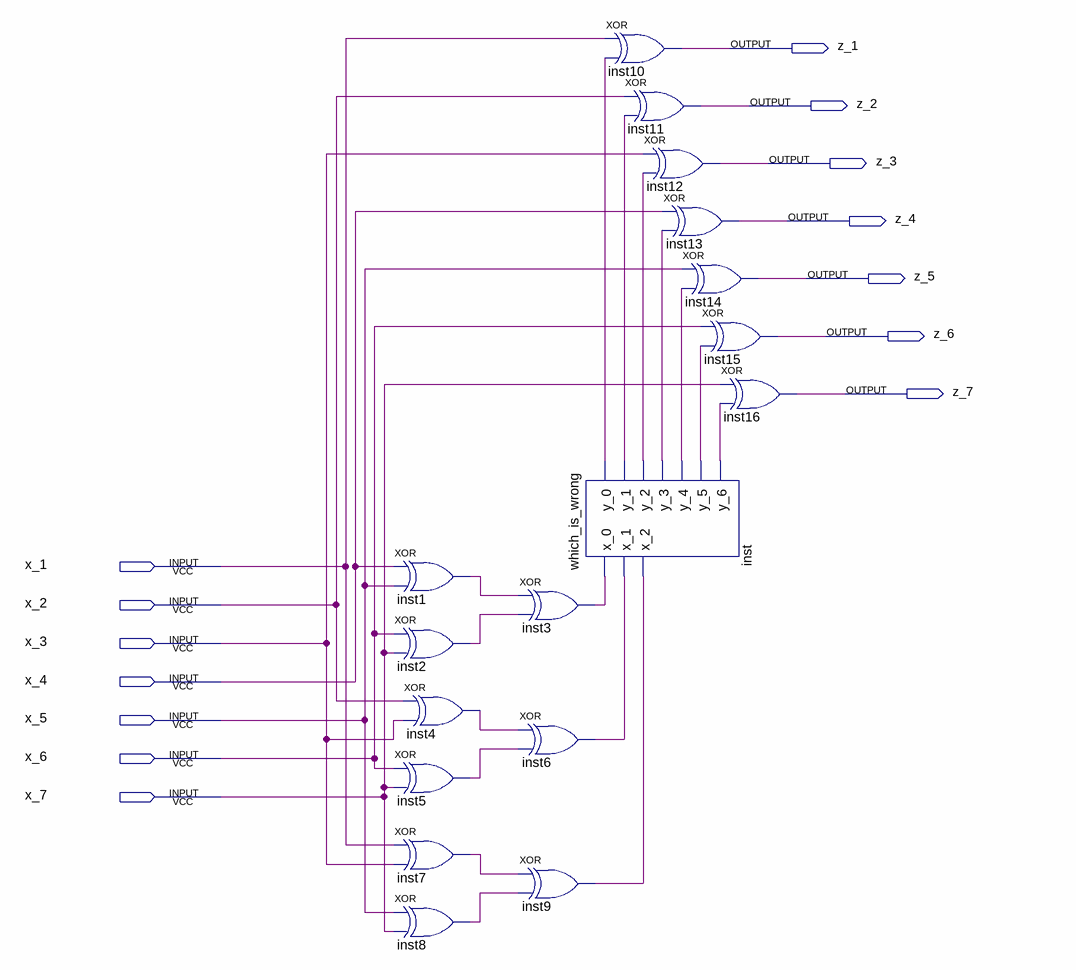
[diagram p0: schematic sheet]
// Quartus schematic decoding_H.bdf as structural Verilog: 17 symbols, 14 pins
module decoding_H (
  input  x_1,
  input  x_2,
  input  x_3,
  input  x_4,
  input  x_5,
  input  x_6,
  input  x_7,
  output z_1,
  output z_2,
  output z_3,
  output z_4,
  output z_5,
  output z_6,
  output z_7
);

  wire inst1_out, inst2_out, inst3_out, inst4_out, inst5_out, inst6_out, inst7_out, inst8_out, inst9_out,
       inst_y_0, inst_y_1, inst_y_2, inst_y_3, inst_y_4, inst_y_5, inst_y_6;

  xor inst1 (inst1_out, x_4, x_5);
  xor inst2 (inst2_out, x_6, x_7);
  xor inst4 (inst4_out, x_2, x_3);
  xor inst5 (inst5_out, x_6, x_7);
  xor inst7 (inst7_out, x_1, x_3);
  xor inst8 (inst8_out, x_5, x_7);
  xor inst3 (inst3_out, inst1_out, inst2_out);
  xor inst6 (inst6_out, inst4_out, inst5_out);
  xor inst9 (inst9_out, inst7_out, inst8_out);
  xor inst10 (z_1, x_1, inst_y_0);
  which_is_wrong inst (
    .x_0(inst3_out), .x_1(inst6_out), .x_2(inst9_out), .y_0(inst_y_0), .y_1(inst_y_1), .y_2(inst_y_2),
    .y_3(inst_y_3), .y_4(inst_y_4), .y_5(inst_y_5), .y_6(inst_y_6));
  xor inst11 (z_2, x_2, inst_y_1);
  xor inst12 (z_3, x_3, inst_y_2);
  xor inst13 (z_4, x_4, inst_y_3);
  xor inst14 (z_5, x_5, inst_y_4);
  xor inst15 (z_6, x_6, inst_y_5);
  xor inst16 (z_7, x_7, inst_y_6);
endmodule
